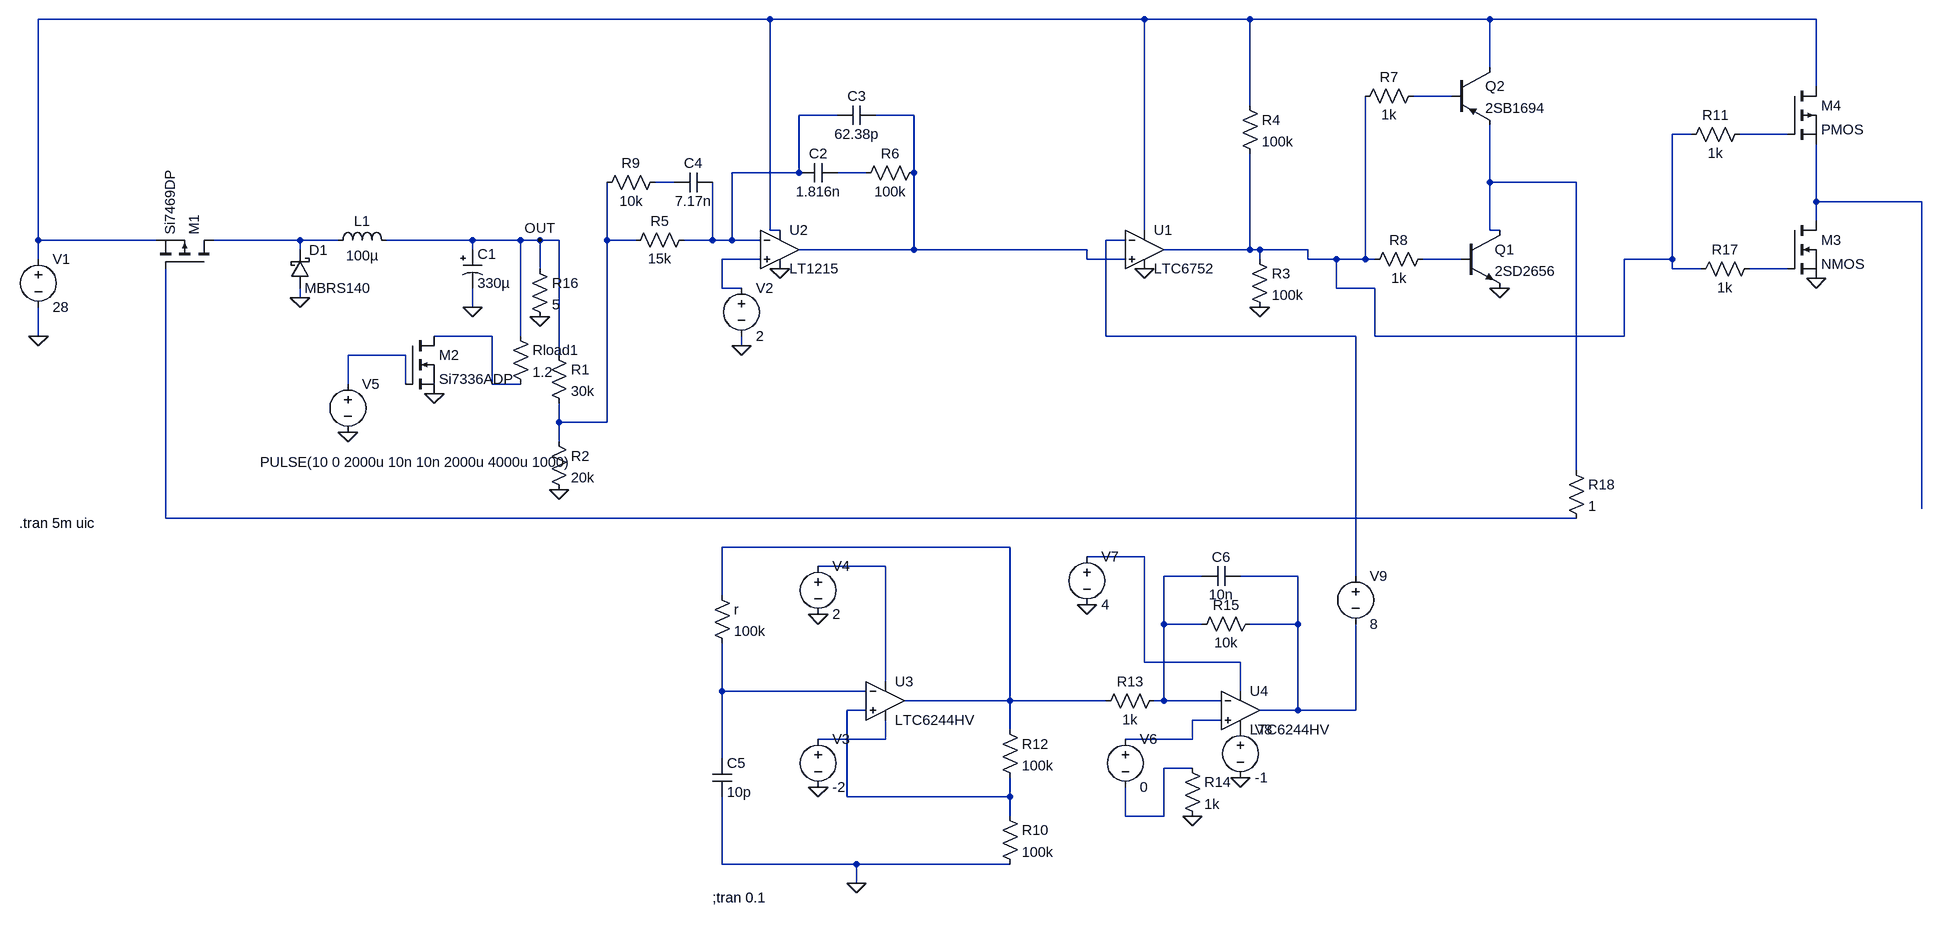
[diagram p0: schematic Kağan_Abi_Buck_With_Feedback.asc]
Kağan_Abi_Buck_With_Feedback.asc, the LTspice schematic file:
Version 4
SHEET 1 2216 1192
WIRE 80 -288 -1280 -288
WIRE 704 -288 80 -288
WIRE 880 -288 704 -288
WIRE 1280 -288 880 -288
WIRE 1824 -288 1280 -288
WIRE 1280 -208 1280 -288
WIRE 1824 -176 1824 -288
WIRE 1216 -160 1152 -160
WIRE 880 -144 880 -288
WIRE 192 -128 128 -128
WIRE 320 -128 256 -128
WIRE 1616 -96 1584 -96
WIRE 1776 -96 1696 -96
WIRE 128 -32 128 -128
WIRE 128 -32 16 -32
WIRE 240 -32 192 -32
WIRE 320 -32 320 -128
WIRE -80 -16 -112 -16
WIRE 1280 -16 1280 -112
WIRE 1424 -16 1280 -16
WIRE 1824 16 1824 -80
WIRE 2000 16 1824 16
WIRE 1824 48 1824 16
WIRE 80 64 80 -288
WIRE 96 64 80 64
WIRE 704 64 704 -288
WIRE 1280 64 1280 -16
WIRE 1296 64 1280 64
WIRE -1280 80 -1280 -288
WIRE -944 80 -1280 80
WIRE -704 80 -848 80
WIRE -640 80 -704 80
WIRE -416 80 -560 80
WIRE -336 80 -416 80
WIRE -304 80 -336 80
WIRE -272 80 -304 80
WIRE -192 80 -192 -16
WIRE -144 80 -192 80
WIRE -16 80 -16 -16
WIRE -16 80 -64 80
WIRE 16 80 16 -32
WIRE 16 80 -16 80
WIRE 64 80 16 80
WIRE 672 80 640 80
WIRE -704 96 -704 80
WIRE -416 96 -416 80
WIRE 256 96 128 96
WIRE 320 96 320 -32
WIRE 320 96 256 96
WIRE 608 96 320 96
WIRE 816 96 736 96
WIRE 880 96 880 -64
WIRE 880 96 816 96
WIRE 896 96 880 96
WIRE 976 96 896 96
WIRE -1280 112 -1280 80
WIRE 64 112 0 112
WIRE 608 112 608 96
WIRE 672 112 608 112
WIRE 896 112 896 96
WIRE 976 112 976 96
WIRE 1024 112 976 112
WIRE 1072 112 1072 -160
WIRE 1072 112 1024 112
WIRE 1088 112 1072 112
WIRE 1232 112 1168 112
WIRE 1584 112 1584 -96
WIRE 1584 112 1504 112
WIRE -304 128 -304 80
WIRE 1584 128 1584 112
WIRE 1632 128 1584 128
WIRE 1776 128 1712 128
WIRE 0 160 0 112
WIRE 32 160 0 160
WIRE 1024 160 1024 112
WIRE 1088 160 1024 160
WIRE -704 176 -704 160
WIRE -416 192 -416 160
WIRE -1280 240 -1280 192
WIRE -384 240 -480 240
WIRE -336 240 -336 80
WIRE 640 240 640 80
WIRE 1056 240 640 240
WIRE 1088 240 1088 160
WIRE 1504 240 1504 112
WIRE 1504 240 1088 240
WIRE 32 256 32 240
WIRE -528 272 -624 272
WIRE -272 272 -272 80
WIRE -624 320 -624 272
WIRE -528 320 -528 272
WIRE -384 320 -384 240
WIRE -336 320 -384 320
WIRE -272 384 -272 352
WIRE -192 384 -192 80
WIRE -192 384 -272 384
WIRE -272 416 -272 384
WIRE 1424 464 1424 -16
WIRE 2000 528 2000 16
WIRE -928 544 -928 128
WIRE 1424 544 -928 544
WIRE 480 592 0 592
WIRE 704 608 608 608
WIRE 272 624 160 624
WIRE 800 640 736 640
WIRE 960 640 864 640
WIRE 1056 640 1056 240
WIRE 0 672 0 592
WIRE 736 720 736 640
WIRE 800 720 736 720
WIRE 960 720 960 640
WIRE 960 720 880 720
WIRE 704 784 704 608
WIRE 864 784 704 784
WIRE 272 816 272 624
WIRE 0 832 0 752
WIRE 240 832 0 832
WIRE 864 832 864 784
WIRE 480 848 480 592
WIRE 480 848 304 848
WIRE 640 848 480 848
WIRE 736 848 736 720
WIRE 736 848 720 848
WIRE 832 848 736 848
WIRE 240 864 208 864
WIRE 960 864 960 720
WIRE 960 864 896 864
WIRE 1056 864 1056 720
WIRE 1056 864 960 864
WIRE 832 880 784 880
WIRE 480 896 480 848
WIRE 272 912 272 880
WIRE 272 912 160 912
WIRE 784 912 784 880
WIRE 784 912 672 912
WIRE 0 944 0 832
WIRE 784 960 736 960
WIRE 208 1008 208 864
WIRE 480 1008 480 976
WIRE 480 1008 208 1008
WIRE 480 1040 480 1008
WIRE 672 1040 672 992
WIRE 736 1040 736 960
WIRE 736 1040 672 1040
WIRE 0 1120 0 1008
WIRE 224 1120 0 1120
WIRE 480 1120 224 1120
WIRE 224 1152 224 1120
FLAG -1280 240 0
FLAG -704 176 0
FLAG -416 192 0
FLAG -304 80 OUT
FLAG 32 256 0
FLAG -272 496 0
FLAG 96 128 0
FLAG 896 192 0
FLAG 704 128 0
FLAG 1296 160 0
FLAG 160 704 0
FLAG 224 1152 0
FLAG 160 992 0
FLAG -624 400 0
FLAG -480 336 0
FLAG -304 208 0
FLAG 608 688 0
FLAG 864 976 0
FLAG 784 1040 0
FLAG 1824 144 0
DATAFLAG 256 96 ""
DATAFLAG 816 96 ""
SYMBOL ind -656 96 R270
WINDOW 0 32 56 VTop 2
WINDOW 3 5 56 VBottom 2
SYMATTR InstName L1
SYMATTR Value 100µ
SYMATTR SpiceLine Rser=0.1
SYMBOL schottky -720 160 M180
WINDOW 0 31 63 Left 2
WINDOW 3 24 0 Left 2
SYMATTR InstName D1
SYMATTR Value MBRS140
SYMBOL POLCAP -432 96 R0
SYMATTR InstName C1
SYMATTR Value 330µ
SYMATTR SpiceLine Rser=0.07
SYMBOL VOLTAGE -1280 96 R0
WINDOW 123 0 0 Left 2
WINDOW 39 0 0 Left 2
SYMATTR InstName V1
SYMATTR Value 28
SYMBOL res -352 224 R0
SYMATTR InstName Rload1
SYMATTR Value 1.2
SYMBOL voltage 32 144 R0
WINDOW 123 0 0 Left 2
WINDOW 39 0 0 Left 2
SYMATTR InstName V2
SYMATTR Value 2
SYMBOL res -288 256 R0
SYMATTR InstName R1
SYMATTR Value 30k
SYMBOL res -288 400 R0
SYMATTR InstName R2
SYMATTR Value 20k
SYMBOL res 880 96 R0
SYMATTR InstName R3
SYMATTR Value 100k
SYMBOL res 864 -160 R0
SYMATTR InstName R4
SYMATTR Value 100k
SYMBOL pmos -848 128 M270
SYMATTR InstName M1
SYMATTR Value Si7469DP
SYMBOL res -48 64 R90
WINDOW 0 0 56 VBottom 2
WINDOW 3 32 56 VTop 2
SYMATTR InstName R5
SYMATTR Value 15k
SYMBOL npn 1232 64 R0
SYMATTR InstName Q1
SYMATTR Value 2SD2656
SYMBOL Comparators\\LTC6752 704 32 R0
SYMATTR InstName U1
SYMBOL Opamps\\LT1215 96 32 R0
SYMATTR InstName U2
SYMBOL res 336 -48 R90
WINDOW 0 0 56 VBottom 2
WINDOW 3 32 56 VTop 2
SYMATTR InstName R6
SYMATTR Value 100k
SYMBOL cap 192 -48 R90
WINDOW 0 0 32 VBottom 2
WINDOW 3 32 32 VTop 2
SYMATTR InstName C2
SYMATTR Value 1.816n
SYMBOL cap 256 -144 R90
WINDOW 0 0 32 VBottom 2
WINDOW 3 32 32 VTop 2
SYMATTR InstName C3
SYMATTR Value 62.38p
SYMBOL pnp 1216 -208 R0
SYMATTR InstName Q2
SYMATTR Value 2SB1694
SYMBOL res 1168 -176 R90
WINDOW 0 0 56 VBottom 2
WINDOW 3 32 56 VTop 2
SYMATTR InstName R7
SYMATTR Value 1k
SYMBOL res 1184 96 R90
WINDOW 0 0 56 VBottom 2
WINDOW 3 32 56 VTop 2
SYMATTR InstName R8
SYMATTR Value 1k
SYMBOL Opamps\\LTC6244HV 272 848 R0
SYMATTR InstName U3
SYMBOL voltage 160 608 R0
WINDOW 123 0 0 Left 2
WINDOW 39 0 0 Left 2
SYMATTR InstName V4
SYMATTR Value 2
SYMBOL res 464 1024 R0
SYMATTR InstName R10
SYMATTR Value 100k
SYMBOL res -16 656 R0
SYMATTR InstName r
SYMATTR Value 100k
SYMBOL res 464 880 R0
SYMATTR InstName R12
SYMATTR Value 100k
SYMBOL cap -16 944 R0
SYMATTR InstName C5
SYMATTR Value 10p
SYMBOL Opamps\\LTC6244HV 864 864 R0
SYMATTR InstName U4
SYMBOL res 736 832 R90
WINDOW 0 0 56 VBottom 2
WINDOW 3 32 56 VTop 2
SYMATTR InstName R13
SYMATTR Value 1k
SYMBOL res 768 944 R0
SYMATTR InstName R14
SYMATTR Value 1k
SYMBOL res 896 704 R90
WINDOW 0 0 56 VBottom 2
WINDOW 3 32 56 VTop 2
SYMATTR InstName R15
SYMATTR Value 10k
SYMBOL cap 864 624 R90
WINDOW 0 0 32 VBottom 2
WINDOW 3 32 32 VTop 2
SYMATTR InstName C6
SYMATTR Value 10n
SYMBOL voltage 160 896 R0
WINDOW 123 0 0 Left 2
WINDOW 39 0 0 Left 2
SYMATTR InstName V3
SYMATTR Value -2
SYMBOL voltage -624 304 R0
WINDOW 3 -146 146 Left 2
WINDOW 123 0 0 Left 2
WINDOW 39 0 0 Left 2
SYMATTR Value PULSE(10 0 2000u 10n 10n 2000u 4000u 1000)
SYMATTR InstName V5
SYMBOL nmos -528 240 R0
SYMATTR InstName M2
SYMATTR Value Si7336ADP
SYMBOL res -320 112 R0
SYMATTR InstName R16
SYMATTR Value 5
SYMBOL cap -16 -32 R90
WINDOW 0 0 32 VBottom 2
WINDOW 3 32 32 VTop 2
SYMATTR InstName C4
SYMATTR Value 7.17n
SYMBOL voltage 608 592 R0
WINDOW 123 0 0 Left 2
WINDOW 39 0 0 Left 2
SYMATTR InstName V7
SYMATTR Value 4
SYMBOL res -96 -32 R90
WINDOW 0 0 56 VBottom 2
WINDOW 3 32 56 VTop 2
SYMATTR InstName R9
SYMATTR Value 10k
SYMBOL voltage 864 880 R0
WINDOW 123 0 0 Left 2
WINDOW 39 0 0 Left 2
SYMATTR InstName V8
SYMATTR Value -1
SYMBOL voltage 1056 624 R0
WINDOW 123 0 0 Left 2
WINDOW 39 0 0 Left 2
SYMATTR InstName V9
SYMATTR Value 8
SYMBOL nmos 1776 48 R0
SYMATTR InstName M3
SYMBOL pmos 1776 -176 R0
SYMATTR InstName M4
SYMBOL res 1712 -112 R90
WINDOW 0 0 56 VBottom 2
WINDOW 3 32 56 VTop 2
SYMATTR InstName R11
SYMATTR Value 1k
SYMBOL res 1728 112 R90
WINDOW 0 0 56 VBottom 2
WINDOW 3 32 56 VTop 2
SYMATTR InstName R17
SYMATTR Value 1k
SYMBOL res 1408 448 R0
SYMATTR InstName R18
SYMATTR Value 1
SYMBOL voltage 672 896 R0
WINDOW 123 0 0 Left 2
WINDOW 39 0 0 Left 2
SYMATTR InstName V6
SYMATTR Value 0
TEXT -1312 552 Left 2 !.tran 5m uic
TEXT -16 1176 Left 2 !;tran 0.1

The netlist it stands for:
* Kağan_Abi_Buck_With_Feedback.asc
L1 N011 OUT 100µ Rser=0.1
D1 0 N011 MBRS140
C1 OUT 0 330µ Rser=0.07
V1 N001 0 28
Rload1 OUT N017 1.2
V2 N014 0 2
R1 OUT N012 30k
R2 N012 0 20k
R3 N005 0 100k
R4 N001 N005 100k
M1 N011 N019 N001 N001 Si7469DP
R5 N003 N012 15k
Q1 N009 N015 0 0 2SD2656
XU1 N004 N013 N001 0 N005 LTC6752  ; pins In+ In- V+ V- OUT
XU2 N014 N003 N001 0 N004 LT1215  ; pins In+ In- V+ V- OUT
R6 N004 N007 100k
C2 N007 N003 1.816n
C3 N004 N003 62.38p
Q2 N001 N002 N009 0 2SB1694
R7 N002 N005 1k
R8 N015 N005 1k
XU3 N026 N025 N022 N028 N020 LTC6244HV  ; pins In+ In- V+ V- OUT
V4 N022 0 2
R10 N026 0 100k
r N020 N025 100k
R12 N020 N026 100k
C5 N025 0 10p
XU4 N027 N023 N021 P001 N024 LTC6244HV  ; pins In+ In- V+ V- OUT
R13 N023 N020 1k
R14 N029 0 1k
R15 N024 N023 10k
C6 N024 N023 10n
V3 N028 0 -2
V5 N018 0 PULSE(10 0 2000u 10n 10n 2000u 4000u 1000)
M2 N017 N018 0 0 Si7336ADP
R16 OUT 0 5
C4 N003 N008 7.17n
V7 N021 0 4
R9 N008 N012 10k
V8 P001 0 -1
V9 N013 N024 8
M3 N010 N016 0 0 NMOS
M4 N001 N006 N010 N010 PMOS
R11 N006 N005 1k
R17 N016 N005 1k
R18 N009 N019 1
V6 N027 N029 0
.model D D
.lib standard.dio
.model NPN NPN
.model PNP PNP
.lib standard.bjt
.model NMOS NMOS
.model PMOS PMOS
.lib standard.mos
.tran 5m uic
;tran 0.1
.lib LTC7.lib
.lib LTC.lib
.lib LTC5.lib
.backanno
.end